# EAGLE design pci_stub (EAGLE 4.11)
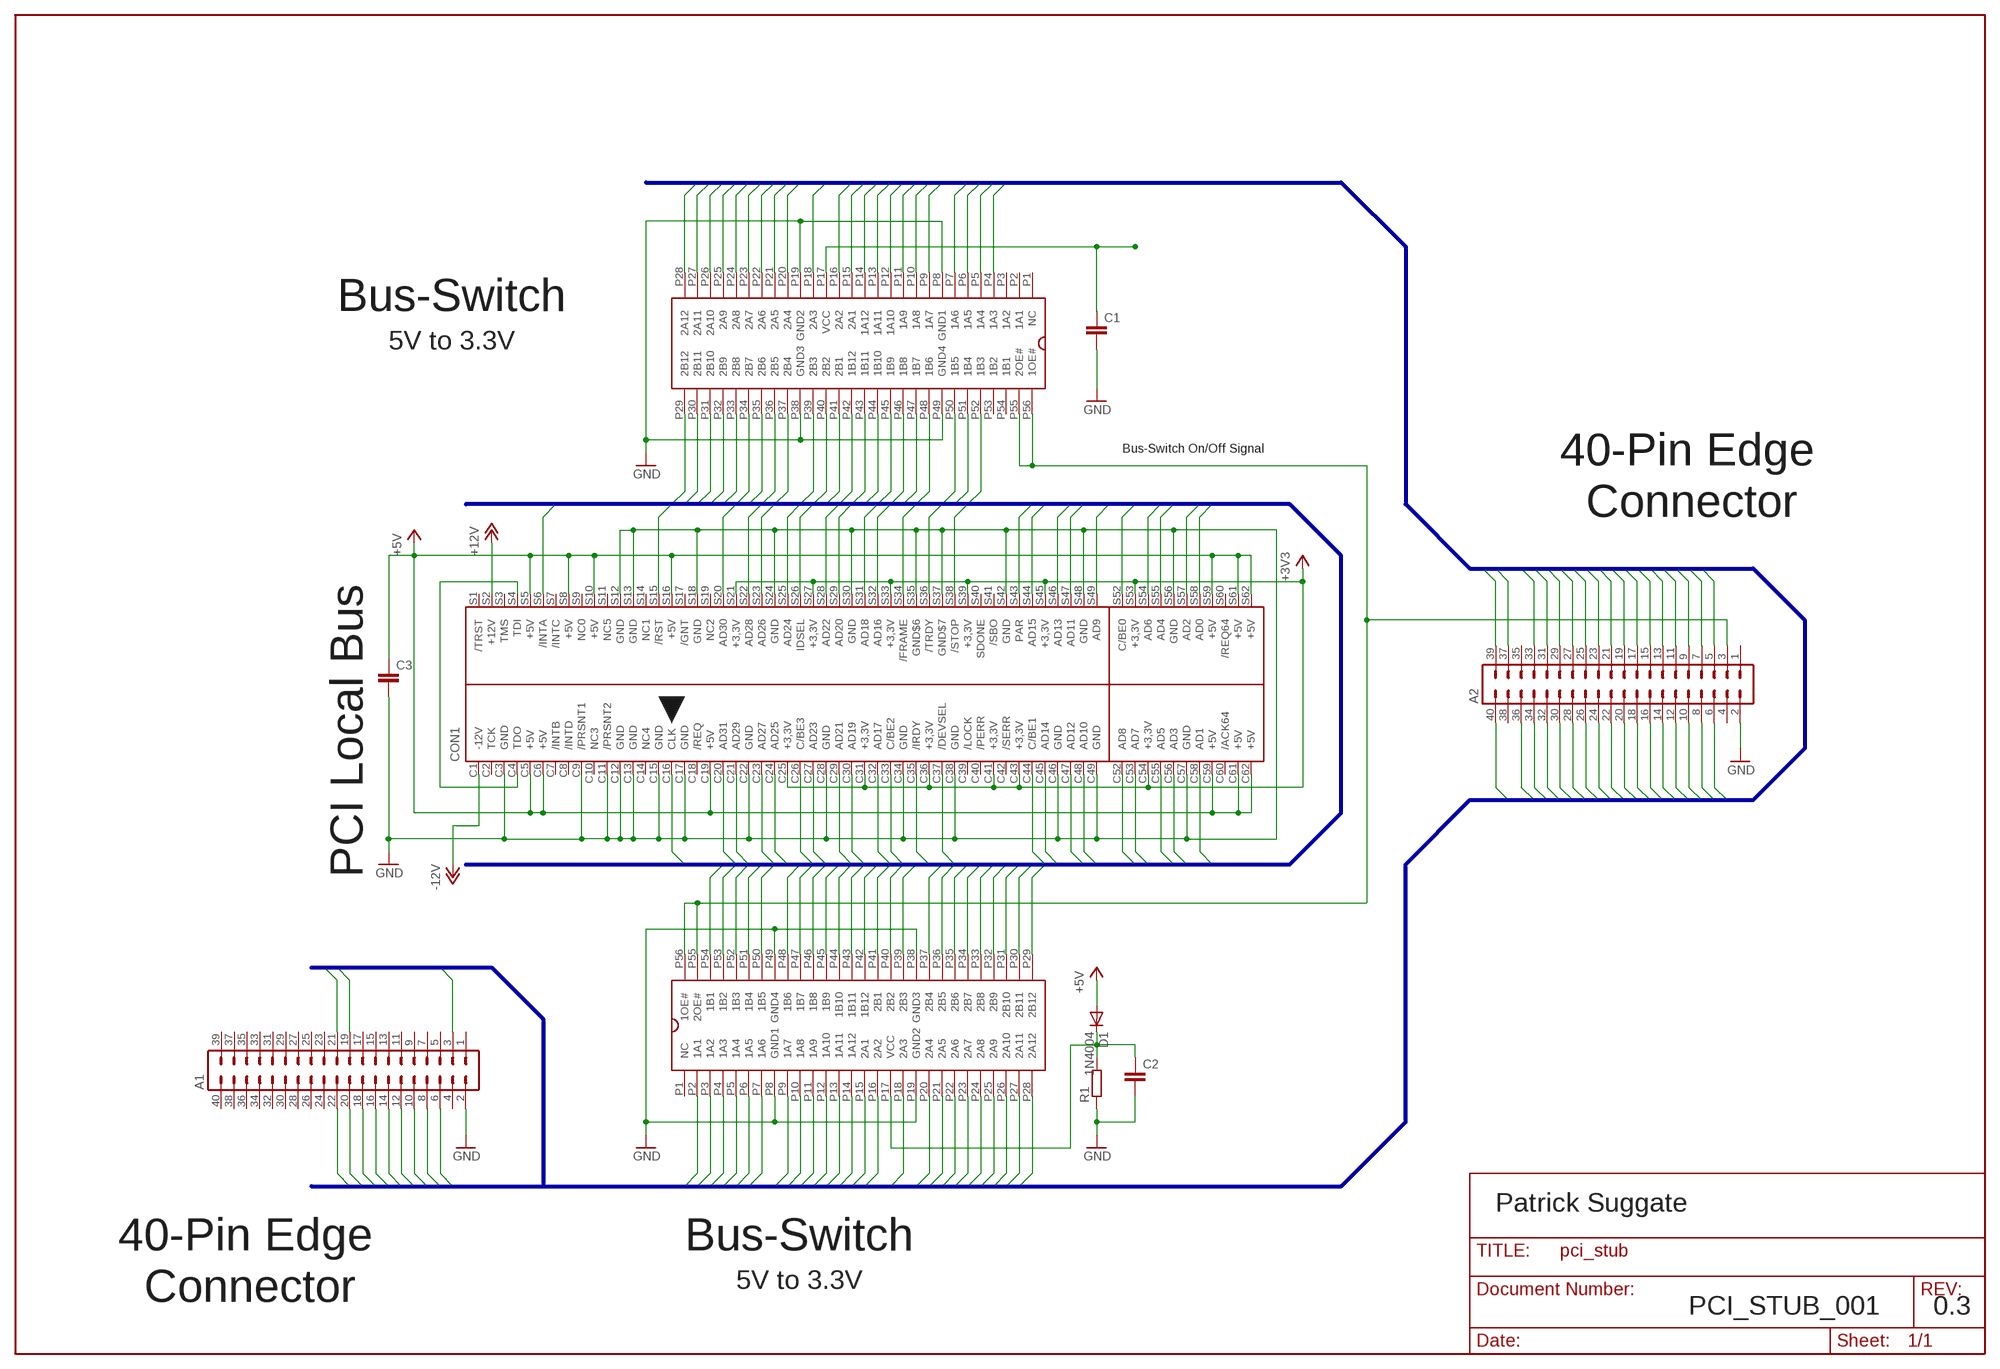
[diagram p0: schematic, sheet 1]

## Parts
A1  ML40L  [ML40L]
A2  ML40L  [ML40L]
C1  C-EU025-030X050  [C025-030X050]
C2  C-EU025-030X050  [C025-030X050]
C3  C-EU025-025X050  [C025-025X050]
CON1  PCI_CON  [PCI_BRDL]
D1  1N4004  [DO41-10]
R1  R-EU_0207/10  [0207/10]
U$1  CBT16211DDG  [TSSOP56]
U$2  CBT16211DDG  [TSSOP56]

## Nets
4.3V: C1.1 C2.1 D1.C R1.2 U$1.P17(VCC) U$2.P17(VCC)
+3V3: CON1.C25(+3,3V) CON1.C31(+3,3V) CON1.C36(+3,3V) CON1.C41(+3,3V) CON1.C43(+3,3V) CON1.C54(+3,3V) CON1.S21(+3,3V) CON1.S27(+3,3V) CON1.S33(+3,3V) CON1.S39(+3,3V) CON1.S45(+3,3V) CON1.S53(+3,3V)
+5V: C3.1 CON1.C5(+5V) CON1.C6(+5V) CON1.C19(+5V) CON1.C59(+5V) CON1.C61(+5V) CON1.C62(+5V) CON1.S5(+5V) CON1.S8(+5V) CON1.S10(+5V) CON1.S16(+5V) CON1.S59(+5V) CON1.S61(+5V) CON1.S62(+5V) D1.A
+12V: CON1.S2(+12V)
-12V: CON1.C1(-12V)
AD0: A2.39 U$1.P52(1B3)
AD1: A2.37 U$1.P51(1B4)
AD2: A2.33 U$1.P50(1B5)
AD3: A2.34 U$1.P48(1B6)
AD4: A2.31 U$1.P47(1B7)
AD5: A2.32 U$1.P46(1B8)
AD6: A2.29 U$1.P45(1B9)
AD7: A2.30 U$1.P44(1B10)
AD8: A2.28 U$1.P42(1B12)
AD9: A2.25 U$1.P41(2B1)
AD10: A2.26 U$1.P40(2B2)
AD11: A2.23 U$1.P39(2B3)
AD12: A2.24 U$1.P37(2B4)
AD13: A2.21 U$1.P36(2B5)
AD14: A2.22 U$1.P35(2B6)
AD15: A2.19 U$1.P34(2B7)
AD16: A2.11 U$2.P51(1B4)
AD17: A2.12 U$2.P50(1B5)
AD18: A2.9 U$2.P48(1B6)
AD19: A2.10 U$2.P47(1B7)
AD20: A2.7 U$2.P46(1B8)
AD21: A2.8 U$2.P45(1B9)
AD22: A2.5 U$2.P44(1B10)
AD23: A2.6 U$2.P43(1B11)
AD24: A1.19 U$2.P40(2B2)
AD25: A1.20 U$2.P39(2B3)
AD26: A1.18 U$2.P37(2B4)
AD27: A1.16 U$2.P36(2B5)
AD28: A1.14 U$2.P35(2B6)
AD29: A1.12 U$2.P34(2B7)
AD30: A1.10 U$2.P33(2B8)
AD31: A1.8 U$2.P32(2B9)
CBE0: A2.27 U$1.P43(1B11)
CBE1: A2.20 U$1.P33(2B8)
CBE2: A2.14 U$2.P52(1B3)
CBE3: A1.22 U$2.P41(2B1)
DEVSEL: A2.18 U$1.P30(2B11)
FRAME: A2.13 U$2.P53(1B2)
GND: A1.2 A2.2 C1.2 C2.2 C3.2 CON1.C3(GND) CON1.C9(/PRSNT1) CON1.C11(/PRSNT2) CON1.C12(GND) CON1.C13(GND) CON1.C15(GND) CON1.C17(GND) CON1.C22(GND) CON1.C28(GND) CON1.C34(GND) CON1.C38(GND) CON1.C46(GND) CON1.C49(GND) CON1.C57(GND) CON1.S12(GND) CON1.S13(GND) CON1.S18(GND) CON1.S24(GND) CON1.S30(GND) CON1.S35(GND$6) CON1.S37(GND$7) CON1.S42(GND) CON1.S48(GND) CON1.S56(GND) R1.1 U$1.P8(GND1) U$1.P19(GND2) U$1.P38(GND3) U$1.P49(GND4) U$2.P8(GND1) U$2.P19(GND2) U$2.P38(GND3) U$2.P49(GND4)
IDSEL: A1.21 U$2.P42(1B12)
INTA: A1.3 U$2.P29(2B12)
IRDY: A2.16 U$2.P54(1B1)
JTAG: CON1.C4(TDO) CON1.S4(TDI)
OE#: A2.3 U$1.P55(2OE#) U$1.P56(1OE#) U$2.P55(2OE#) U$2.P56(1OE#)
PAR: A2.17 U$1.P32(2B9)
PCI_AD0: CON1.S58(AD0) U$1.P4(1A3)
PCI_AD1: CON1.C58(AD1) U$1.P5(1A4)
PCI_AD2: CON1.S57(AD2) U$1.P6(1A5)
PCI_AD3: CON1.C56(AD3) U$1.P7(1A6)
PCI_AD4: CON1.S55(AD4) U$1.P9(1A7)
PCI_AD5: CON1.C55(AD5) U$1.P10(1A8)
PCI_AD6: CON1.S54(AD6) U$1.P11(1A9)
PCI_AD7: CON1.C53(AD7) U$1.P12(1A10)
PCI_AD8: CON1.C52(AD8) U$1.P14(1A12)
PCI_AD9: CON1.S49(AD9) U$1.P15(2A1)
PCI_AD10: CON1.C48(AD10) U$1.P16(2A2)
PCI_AD11: CON1.S47(AD11) U$1.P18(2A3)
PCI_AD12: CON1.C47(AD12) U$1.P20(2A4)
PCI_AD13: CON1.S46(AD13) U$1.P21(2A5)
PCI_AD14: CON1.C45(AD14) U$1.P22(2A6)
PCI_AD15: CON1.S44(AD15) U$1.P23(2A7)
PCI_AD16: CON1.S32(AD16) U$2.P5(1A4)
PCI_AD17: CON1.C32(AD17) U$2.P6(1A5)
PCI_AD18: CON1.S31(AD18) U$2.P7(1A6)
PCI_AD19: CON1.C30(AD19) U$2.P9(1A7)
PCI_AD20: CON1.S29(AD20) U$2.P10(1A8)
PCI_AD21: CON1.C29(AD21) U$2.P11(1A9)
PCI_AD22: CON1.S28(AD22) U$2.P12(1A10)
PCI_AD23: CON1.C27(AD23) U$2.P13(1A11)
PCI_AD24: CON1.S25(AD24) U$2.P16(2A2)
PCI_AD25: CON1.C24(AD25) U$2.P18(2A3)
PCI_AD26: CON1.S23(AD26) U$2.P20(2A4)
PCI_AD27: CON1.C23(AD27) U$2.P21(2A5)
PCI_AD28: CON1.S22(AD28) U$2.P22(2A6)
PCI_AD29: CON1.C21(AD29) U$2.P23(2A7)
PCI_AD30: CON1.S20(AD30) U$2.P24(2A8)
PCI_AD31: CON1.C20(AD31) U$2.P25(2A9)
PCI_CBE0: CON1.S52(C/BE0) U$1.P13(1A11)
PCI_CBE1: CON1.C44(C/BE1) U$1.P24(2A8)
PCI_CBE2: CON1.C33(C/BE2) U$2.P4(1A3)
PCI_CBE3: CON1.C26(C/BE3) U$2.P15(2A1)
PCI_CLK: CON1.C16(CLK) U$2.P26(2A10)
PCI_CLOCK: A2.36 U$2.P31(2B10)
PCI_DEVSEL: CON1.C37(/DEVSEL) U$1.P27(2A11)
PCI_FRAME: CON1.S34(/FRAME) U$2.P3(1A2)
PCI_IDSEL: CON1.S26(IDSEL) U$2.P14(1A12)
PCI_INTA: CON1.S6(/INTA) U$2.P28(2A12)
PCI_IRDY: CON1.C35(/IRDY) U$2.P2(1A1)
PCI_PAR: CON1.S43(PAR) U$1.P25(2A9)
PCI_RST: CON1.S15(/RST) U$2.P27(2A11)
PCI_STOP: CON1.S38(/STOP) U$1.P26(2A10)
PCI_TRDY: CON1.S36(/TRDY) U$1.P28(2A12)
RST: A1.6 U$2.P30(2B11)
STOP: A2.40 U$1.P31(2B10)
TRDY: A2.15 U$1.P29(2B12)
Unconnected: A1.1 A1.4 A1.5 A1.7 A1.9 A1.11 A1.13 A1.15 A1.17 A1.23 A1.24 A1.25 A1.26 A1.27 A1.28 A1.29 A1.30 A1.31 A1.32 A1.33 A1.34 A1.35 A1.36 A1.37 A1.38 A1.39 A1.40 A2.1 A2.4 A2.35 A2.38 CON1.C2(TCK) CON1.C7(/INTB) CON1.C8(/INTD) CON1.C10(NC3) CON1.C14(NC4) CON1.C18(/REQ) CON1.C39(/LOCK) CON1.C40(/PERR) CON1.C42(/SERR) CON1.C60(/ACK64) CON1.S1(/TRST) CON1.S3(TMS) CON1.S7(/INTC) CON1.S9(NC0) CON1.S11(NC5) CON1.S14(NC1) CON1.S17(/GNT) CON1.S19(NC2) CON1.S40(SDONE) CON1.S41(/SBO) CON1.S60(/REQ64) U$1.P1(NC) U$1.P2(1A1) U$1.P3(1A2) U$1.P53(1B2) U$1.P54(1B1) U$2.P1(NC)

## Buses
B$2

## Notes on the sheet
- Bus-Switch
- 5V to 3.3V
- Bus-Switch On/Off Signal
- 40-Pin Edge
- Connector
- PCI Local Bus
- Patrick Suggate
- 40-Pin Edge | Bus-Switch
- 5V to 3.3V
- Connector
- PCI_STUB_001 | 0.3

## Library data of the parts
A1 A2 = con-ml:ML40L: HARTING
C1-C3 = rcl:C-EU: CAPACITOR, European symbol
CON1 = pci-brd:PCI_CON: PCI BOARD LONG
D1 = diode:1N4004: DIODE general purpose rectifier, 1 A
R1 = rcl:R-EU_: RESISTOR, European symbol
U$1 U$2 = busswitch:CBT16211DDG

## Board
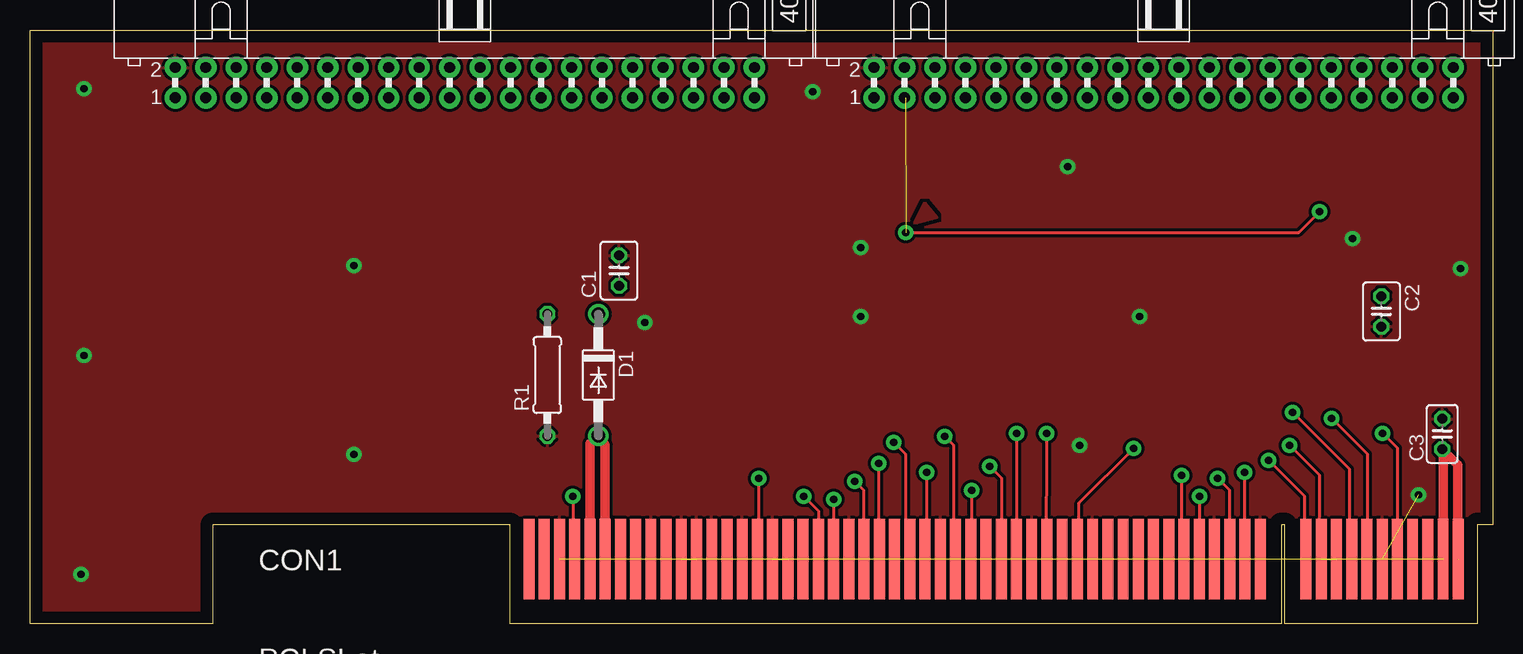
[diagram p1: board, top side]
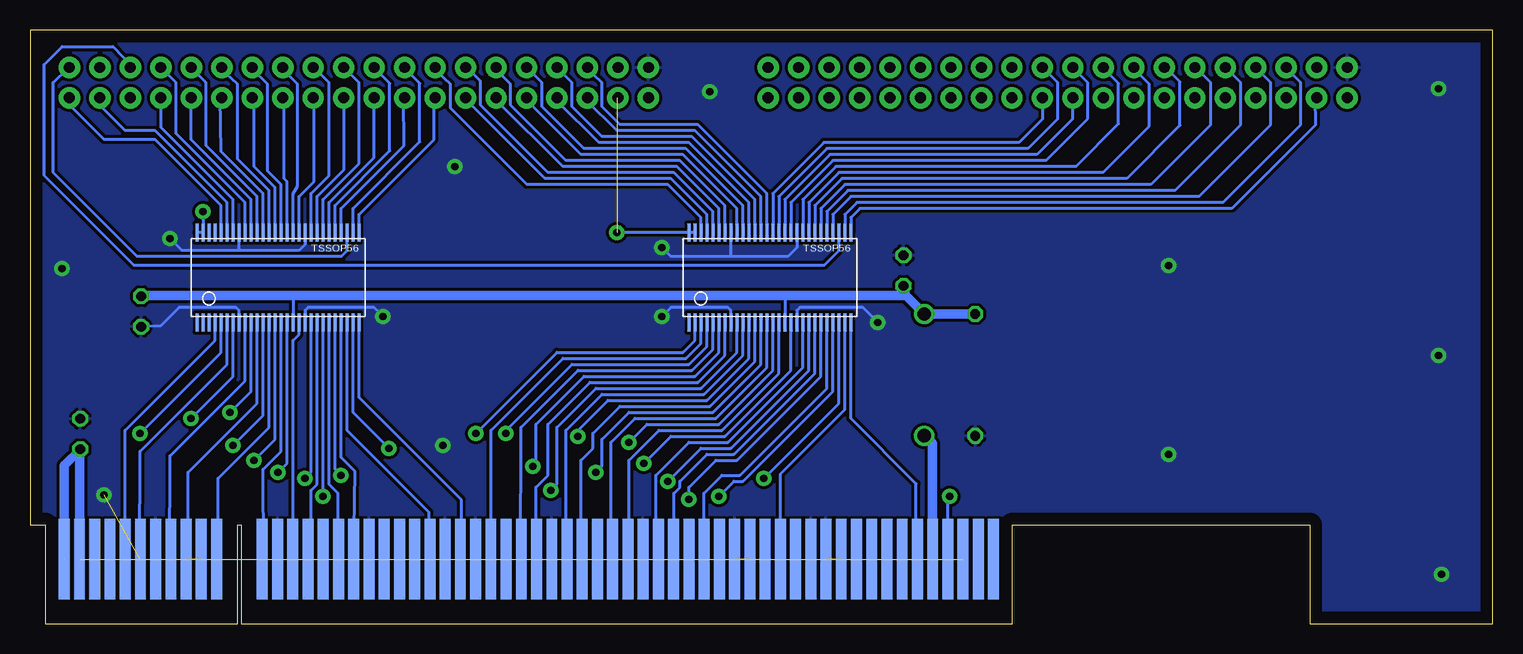
[diagram p2: board, bottom side, seen from below]

Size 121.92 x 49.53 mm. Coordinates in mm from the lower left corner, seen from the top.
Copper layers (1*16): Top 0.035mm / dielectric 1.5mm / Bottom 0.035mm
Design rules "default": minimum track width 8mil, minimum drill 24mil, track to track 8mil, track to pad 8mil, pad to pad 8mil, via to via 8mil, smd to smd 8mil, copper to edge 40mil, drill to drill 8mil, minimum pad ring 10mil, minimum via ring 8mil, stop-mask expansion 4mil, vias tented up to drill 0mil, thermal gap 10mil

### Footprints (pad centres in the part's own frame; a part is rotated, then mirrored left to right if it is on the bottom)
ML40L = drill 0.914 pad 1.778 round: 1 -24.13,-1.27; 2 -24.13,1.27; 3 -21.59,-1.27; 4 -21.59,1.27; 5 -19.05,-1.27; 6 -19.05,1.27; 7 -16.51,-1.27; 8 -16.51,1.27; 9 -13.97,-1.27; 10 -13.97,1.27; 11 -11.43,-1.27; 12 -11.43,1.27; 13 -8.89,-1.27; 14 -8.89,1.27; 15 -6.35,-1.27; 16 -6.35,1.27; 17 -3.81,-1.27; 18 -3.81,1.27; 19 -1.27,-1.27; 20 -1.27,1.27; 21 1.27,-1.27; 22 1.27,1.27; 23 3.81,-1.27; 24 3.81,1.27; 25 6.35,-1.27; 26 6.35,1.27; 27 8.89,-1.27; 28 8.89,1.27; 29 11.43,-1.27; 30 11.43,1.27; 31 13.97,-1.27; 32 13.97,1.27; 33 16.51,-1.27; 34 16.51,1.27; 35 19.05,-1.27; 36 19.05,1.27; 37 21.59,-1.27; 38 21.59,1.27; 39 24.13,-1.27; 40 24.13,1.27
C025-030X050 = drill 0.813 octagon: 1 -1.27,0; 2 1.27,0
C025-025X050 = drill 0.813 octagon: 1 -1.27,0; 2 1.27,0
PCI_BRDL = smd 0.91 x 6.7: C1 41.593,4.763; C2 42.862,4.763; C3 44.133,4.763; C4 45.403,4.763; C5 46.672,4.763; C6 47.943,4.763; C7 49.212,4.763; C8 50.483,4.763; C9 51.752,4.763; C10 53.023,4.763; C11 54.292,4.763; C12 55.562,4.763; C13 56.833,4.763; C14 58.102,4.763; C15 59.373,4.763; C16 60.642,4.763; C17 61.913,4.763; C18 63.182,4.763; C19 64.453,4.763; C20 65.722,4.763; C21 66.993,4.763; C22 68.263,4.763; C23 69.532,4.763; C24 70.802,4.763; C25 72.073,4.763; C26 73.343,4.763; C27 74.612,4.763; C28 75.882,4.763; C29 77.153,4.763; C30 78.422,4.763; C31 79.692,4.763; C32 80.963,4.763; C33 82.233,4.763; C34 83.502,4.763; C35 84.772,4.763; C36 86.043,4.763; C37 87.312,4.763; C38 88.582,4.763; C39 89.853,4.763; C40 91.123,4.763; C41 92.392,4.763; C42 93.662,4.763; C43 94.933,4.763; C44 96.203,4.763; C45 97.472,4.763; C46 98.743,4.763; C47 100.013,4.763; C48 101.282,4.763; C49 102.552,4.763; C52 106.362,4.763; C53 107.632,4.763; C54 108.903,4.763; C55 110.172,4.763; C56 111.442,4.763; C57 112.713,4.763; C58 113.983,4.763; C59 115.252,4.763; C60 116.522,4.763; C61 117.793,4.763; C62 119.062,4.763 | smd 0.91 x 6.7 bottom: S1 41.593,4.763; S2 42.862,4.763; S3 44.133,4.763; S4 45.403,4.763; S5 46.672,4.763; S6 47.943,4.763; S7 49.212,4.763; S8 50.483,4.763; S9 51.752,4.763; S10 53.023,4.763; S11 54.292,4.763; S12 55.562,4.763; S13 56.833,4.763; S14 58.102,4.763; S15 59.373,4.763; S16 60.642,4.763; S17 61.913,4.763; S18 63.182,4.763; S19 64.453,4.763; S20 65.722,4.763; S21 66.993,4.763; S22 68.263,4.763; S23 69.532,4.763; S24 70.802,4.763; S25 72.073,4.763; S26 73.343,4.763; S27 74.612,4.763; S28 75.882,4.763; S29 77.153,4.763; S30 78.422,4.763; S31 79.692,4.763; S32 80.963,4.763; S33 82.233,4.763; S34 83.502,4.763; S35 84.772,4.763; S36 86.043,4.763; S37 87.312,4.763; S38 88.582,4.763; S39 89.853,4.763; S40 91.123,4.763; S41 92.392,4.763; S42 93.662,4.763; S43 94.933,4.763; S44 96.203,4.763; S45 97.472,4.763; S46 98.743,4.763; S47 100.013,4.763; S48 101.282,4.763; S49 102.552,4.763; S52 106.362,4.763; S53 107.632,4.763; S54 108.903,4.763; S55 110.172,4.763; S56 111.442,4.763; S57 112.713,4.763; S58 113.983,4.763; S59 115.252,4.763; S60 116.522,4.763; S61 117.793,4.763; S62 119.062,4.763
DO41-10 = drill 1.118 round: A 5.08,0; C -5.08,0
0207/10 = drill 0.813 octagon: 1 -5.08,0; 2 5.08,0
TSSOP56 = smd 1.524 x 0.254: P1 -5.5,7.5; P2 -5.5,7; P3 -5.5,6.5; P4 -5.5,6; P5 -5.5,5.5; P6 -5.5,5; P7 -5.5,4.5; P8 -5.5,4; P9 -5.5,3.5; P10 -5.5,3; P11 -5.5,2.5; P12 -5.5,2; P13 -5.5,1.5; P14 -5.5,1; P15 -5.5,0.5; P16 -5.5,0; P17 -5.5,-0.5; P18 -5.5,-1; P19 -5.5,-1.5; P20 -5.5,-2; P21 -5.5,-2.5; P22 -5.5,-3; P23 -5.5,-3.5; P24 -5.5,-4; P25 -5.5,-4.5; P26 -5.5,-5; P27 -5.5,-5.5; P28 -5.5,-6; P29 2,-6; P30 2,-5.5; P31 2,-5; P32 2,-4.5; P33 2,-4; P34 2,-3.5; P35 2,-3; P36 2,-2.5; P37 2,-2; P38 2,-1.5; P39 2,-1; P40 2,-0.5; P41 2,0; P42 2,0.5; P43 2,1; P44 2,1.5; P45 2,2; P46 2,2.5; P47 2,3; P48 2,3.5; P49 2,4; P50 2,4.5; P51 2,5; P52 2,5.5; P53 2,6; P54 2,6.5; P55 2,7; P56 2,7.5

### Placement (x,y rotation side)
A1  36.25,45.13 0 top
A2  94.5,45.13 0 top
C1  49.1,29.46 90 top
C2  112.66,26.06 270 top
C3  117.72,15.84 90 top
CON1  0,0.64 0 top
D1  47.38,20.76 270 top
R1  43.12,20.76 90 top
U$1  100.5,30.64 90 bottom
U$2  59.5,30.64 90 bottom

### Tracks (layer width: path | path; a pad name or v marks a point on that pad's centre or on a via)
4.3V
  Bottom 0.254: D1.C 47.25,25.84 47.25,25.64 | 48.92,27.39 49,27.39 | C2.1 112.62,27.36 112.62,27.39 | 100,27.39 U$1.P17 | 59,27.39 U$2.P17
  Bottom 0.8: R1.2 47.25,25.84 | D1.C 48.92,27.39 | 112.62,27.39 100,27.39 59,27.39 49,27.39 49,28.1 C1.1
+3V3  (11 unrouted)
+5V  (8 unrouted)
  Top 0.254: D1.A 47.3,15.68 47.25,15.63 46.69,15.07 46.67,15.06 | 117.79,14.47 117.75,14.51 | 119.11,5.4 119.12,5.38 | 119.11,5.4 CON1.S62 | 119,5.51 119.11,5.4
  Top 0.8: CON1.C6 47.94,14.94 47.25,15.63 | CON1.S61 117.79,14.47 119,13.26 119,5.51 | 46.67,15.06 CON1.S5
  Bottom 0.254: 46.62,5.38 46.64,5.4 CON1.S5 | 117.79,14.47 117.75,14.51 117.72,14.54 C3.1 | 47.31,15.7 47.33,15.68 D1.A
  Bottom 0.8: CON1.S61 117.79,14.47 | CON1.S62 119.06,13.2 117.75,14.51 | CON1.S5 46.67,15.06 47.31,15.7
AD0
  Bottom 0.254: U$1.P52 106,34.88 111.5,40.38 115.75,40.38 118.62,43.26 118.6,43.88 A2.39
AD1
  Bottom 0.254: U$1.P51 105.5,35.13 111.5,41.13 114,41.13 116.12,43.26 116.12,43.92 A2.37
AD2
  Bottom 0.254: U$1.P50 105,35.38 111,41.38 111,43.88 A2.33
AD3
  Bottom 0.254: U$1.P48 104,35.13 109.75,40.88 109.75,45.13 111,46.38 A2.34
AD4
  Bottom 0.254: U$1.P47 103.5,35.38 108.5,40.38 108.48,43.91 A2.31
AD5
  Bottom 0.254: U$1.P46 103,35.63 107.25,39.88 107.25,45.13 108.48,46.35 A2.32
AD6
  Bottom 0.254: U$1.P45 102.5,35.88 106,39.38 106.05,43.92 A2.29
AD7
  Bottom 0.254: U$1.P44 102,36.13 104.62,38.76 104.62,45.01 106.05,46.34 A2.30
AD8
  Bottom 0.254: U$1.P42 101,36.63 102.12,37.76 102.12,45.01 103.47,46.34 A2.28
AD9
  Bottom 0.254: U$1.P41 100.5,36.88 100.75,37.13 100.73,43.91 A2.25
AD10
  Bottom 0.254: U$1.P40 100,35.88 99.62,36.51 99.62,45.01 101.02,46.36 A2.26
AD11
  Bottom 0.254: U$1.P39 99.5,35.63 98.25,36.88 98.23,43.91 A2.23
AD12
  Bottom 0.254: U$1.P37 98.5,35.88 97,37.38 97,45.13 98.23,46.36 A2.24
AD13
  Bottom 0.254: U$1.P36 98,35.63 95.75,37.88 95.75,43.88 A2.21
AD14
  Bottom 0.254: U$1.P35 97.5,35.38 94.5,38.38 94.5,45.13 A2.22
AD15
  Bottom 0.254: U$1.P34 97,35.13 93.25,38.88 93.23,43.91 A2.19
AD16
  Bottom 0.254: U$2.P51 64.5,34.63 68,38.13 77.5,38.13 83.14,43.77 A2.11
AD17
  Bottom 0.254: U$2.P50 64,34.88 67.75,38.63 77.25,38.63 81.88,43.26 81.88,45.01 83.27,46.36 A2.12
AD18
  Bottom 0.254: U$2.P48 63,34.63 67.5,39.13 76,39.13 80.5,43.63 80.5,43.88 A2.9
AD19
  Bottom 0.254: U$2.P47 62.5,34.88 67.25,39.63 75.75,39.63 79.25,43.13 79.25,45.13 80.5,46.38 A2.10
AD20
  Bottom 0.254: U$2.P46 62,35.13 67,40.13 74.5,40.13 77.97,43.6 A2.7
AD21
  Bottom 0.254: U$2.P45 61.5,35.38 66.75,40.63 74.25,40.63 76.75,43.13 76.75,45.13 77.98,46.36 A2.8
AD22
  Bottom 0.254: U$2.P44 61,35.63 66.5,41.13 73,41.13 75.51,43.62 A2.5
AD23
  Bottom 0.254: U$2.P43 60.5,35.88 66.25,41.63 72.75,41.63 74.25,43.13 74.25,45.13 75.52,46.35 A2.6
AD24
  Bottom 0.254: U$2.P40 59,35.38 55.25,39.13 38,39.13 35,42.13 35,43.88 A1.19
AD25
  Bottom 0.254: U$2.P39 58.5,35.13 55,38.63 37.25,38.63 33.75,42.13 33.75,45.13 35,46.38 A1.20
AD26
  Bottom 0.254: U$2.P37 57.5,35.38 54.75,38.13 34.75,38.13 31.19,41.7 31.19,45.07 32.52,46.36 A1.18
AD27
  Bottom 0.254: U$2.P36 57,35.13 54.5,37.63 32.5,37.63 28.62,41.51 28.62,45.01 30.02,46.36 A1.16
AD28
  Bottom 0.254: U$2.P35 56.5,34.88 54.25,37.13 30.5,37.13 26.06,41.57 26.06,45.2 27.23,46.36 A1.14
AD29
  Bottom 0.254: U$2.P34 56,34.63 54,36.63 28.5,36.63 23.5,41.63 23.5,45.13 24.73,46.36 A1.12
AD30
  Bottom 0.254: U$2.P33 55.5,34.38 53.75,36.13 26.5,36.13 21,41.63 21,45.13 22.25,46.38 A1.10
AD31
  Bottom 0.254: U$2.P32 55,34.13 53.5,35.63 24.5,35.63 18.5,41.63 18.5,45.13 19.76,46.38 A1.8
CBE0
  Bottom 0.254: U$1.P43 101.5,36.38 103.25,38.13 103.25,43.63 103.47,43.92 A2.27
CBE1
  Bottom 0.254: U$1.P33 96.5,34.88 91.94,39.45 91.94,45.07 A2.20
CBE2
  Bottom 0.254: U$2.P52 65,34.38 68.25,37.63 78.75,37.63 84.38,43.26 84.38,45.26 85.48,46.36 A2.14
CBE3
  Bottom 0.254: U$2.P41 59.5,35.63 55.5,39.63 38.75,39.63 36.25,42.13 36.25,45.13 A1.22
DEVSEL
  Bottom 0.254: U$1.P30 95,34.63 89.44,40.2 89.44,45.07 90.77,46.36 A2.18
FRAME
  Bottom 0.254: U$2.P53 65.5,34.13 68.5,37.13 79,37.13 85.62,43.76 85.59,43.91 A2.13
GND  (via drill 0.61 pad 1.27)  (24 unrouted)
  Bottom 0.254: U$1.P8 104.5,26.14 104.75,26.39 109.5,26.39 111.03,24.86 C2.2 | U$1.P19 99,26.14 98.75,26.39 93.25,26.39 v92.5,25.64 | U$1.P38 99,31.64 99.5,31.14 104.5,31.14 | 104.5,31.14 109.25,31.14 v110.25,32.13 | 104.5,31.14 U$1.P49 | U$2.P38 58,31.39 58.75,30.64 63.5,30.64 | 63.5,30.64 68.5,30.64 v69.25,31.39 | 63.5,30.64 U$2.P49 | U$2.P19 58,26.14 57.75,26.39 52.5,26.39 v51.25,25.14 | U$2.P8 63.5,26.14 63.75,26.39 68.5,26.39 v69.25,25.64
  other vias: 86.5,38.13 119.25,29.64 115.75,10.76 27,14.13 27,29.89 4.5,44.63 4.5,22.39 4.25,4.13 65.25,44.38 87.5,14.88
  pour Top (isolate 0.254, rank 4): 0,48.88 0,0.64 15.25,0.64 15.25,8.38 40,8.38 40,5.63 121.5,5.63 121.5,48.88
  pour Bottom (isolate 0.254, rank 4): 0,48.88 0,0.64 15.25,0.64 15.25,8.38 40.25,8.38 40.25,5.88 121.25,5.88 121.25,48.88
IDSEL
  Bottom 0.254: U$2.P42 60,35.88 55.75,40.13 39.5,40.13 37.5,42.13 37.5,43.88 A1.21
INTA
  Bottom 0.254: U$2.P29 53.5,33.88 52.75,34.63 21.75,34.63 14.75,41.63 14.77,43.91 A1.3
IRDY
  Bottom 0.254: U$2.P54 66,33.88 68.75,36.63 80.5,36.63 86.88,43.01 86.88,45.01 88.33,46.34 A2.16
JTAG  (via drill 0.61 pad 1.27)
  Top 0.254: 45.49,5.4 45.5,5.38 | 45.49,5.4 CON1.S4 | v45.25,10.63 45.25,5.63 45.49,5.4
  Bottom 0.254: CON1.S4 45.4,10.48 v45.25,10.63
N$1
  pour Top (rank 2): 73.75,33.49 74.62,35.13 75.63,33.89 73.75,33.37
OE#  (via drill 0.61 pad 1.27)  (1 unrouted)
  Top 0.254: 73,43.88 72.98,43.86 A2.3 | v73,32.63 105.75,32.63 v107.5,34.38
  Bottom 0.254: U$2.P55 U$2.P56 v73,32.63 | U$1.P56 U$1.P55 v107.5,34.38
PAR
  Bottom 0.254: U$1.P32 96,34.63 90.75,39.88 90.77,43.91 A2.17
PCI_AD0
  Bottom 0.254: U$1.P4 106.5,23.64 114,16.14 114,5.38 CON1.S58
PCI_AD1  (via drill 0.61 pad 1.27)
  Top 0.254: v112.75,15.88 114,14.63 114,5.38 CON1.C58
  Bottom 0.254: U$1.P5 106,22.64 v112.75,15.88
PCI_AD2
  Bottom 0.254: U$1.P6 105.5,21.64 112.75,14.38 112.79,5.67 CON1.S57
PCI_AD3  (via drill 0.61 pad 1.27)
  Top 0.254: v108.5,17.14 111.5,14.13 111.5,5.38 111.49,5.4 CON1.C56 111.51,5.37
  Bottom 0.254: U$1.P7 105,20.64 v108.5,17.14
PCI_AD4
  Bottom 0.254: U$1.P9 104,20.26 110.25,14.01 110.26,5.37 CON1.S55
PCI_AD5  (via drill 0.61 pad 1.27)
  Top 0.254: v105.25,17.64 110,12.88 110,5.63 110.26,5.37 CON1.C55
  Bottom 0.254: U$1.P10 103.5,19.39 v105.25,17.64
PCI_AD6
  Bottom 0.254: U$1.P11 103,18.39 108.75,12.63 108.75,5.63 109.01,5.37 CON1.S54
PCI_AD7  (via drill 0.61 pad 1.27)
  Top 0.254: v105,14.88 107.5,12.38 107.49,5.37 CON1.C53
  Bottom 0.254: U$1.P12 102.5,17.39 v105,14.88
PCI_AD8  (via drill 0.61 pad 1.27)
  Top 0.254: v103.25,13.63 106.25,10.63 106.24,5.37 CON1.C52
  Bottom 0.254: U$1.P14 101.5,15.38 v103.25,13.63
PCI_AD9
  Bottom 0.254: U$1.P15 101,14.38 102.5,12.88 102.45,5.69 CON1.S49
PCI_AD10  (via drill 0.61 pad 1.27)
  Top 0.254: 101.24,5.37 CON1.C48 101.26,5.4 101.25,5.38 v101.25,12.63
  Bottom 0.254: U$1.P16 100.5,13.38 v101.25,12.63
PCI_AD11
  Bottom 0.254: U$1.P18 99.5,24.14 100,23.64 CON1.S47
PCI_AD12  (via drill 0.61 pad 1.27)
  Top 0.254: v99,12.13 100,11.13 CON1.C47
  Bottom 0.254: U$1.P20 98.5,12.63 v99,12.13
PCI_AD13
  Bottom 0.254: U$1.P21 98,11.63 98.5,11.13 98.5,5.63 98.76,5.38 CON1.S46
PCI_AD14  (via drill 0.61 pad 1.27)
  Top 0.254: CON1.C45 97.51,5.37 v97.5,10.63
  Bottom 0.254: v97.5,10.63 U$1.P22
PCI_AD15
  Bottom 0.254: U$1.P23 97,11.63 96.25,10.88 96.26,5.37 CON1.S44
PCI_AD16
  Bottom 0.254: U$2.P5 65,22.89 66.75,21.14 76.25,21.14 81,16.39 81.01,5.37 CON1.S32
PCI_AD17  (via drill 0.61 pad 1.27)
  Top 0.254: v80,13.13 81,12.13 81.01,5.37 CON1.C32
  Bottom 0.254: U$2.P6 64.5,22.64 66.5,20.64 75.75,20.64 79.75,16.64 79.75,13.38 v80,13.13
PCI_AD18
  Bottom 0.254: U$2.P7 64,22.39 66.25,20.14 75.25,20.14 78.75,16.64 78.75,12.38 79.75,11.38 79.76,5.37 CON1.S31
PCI_AD19  (via drill 0.61 pad 1.27)
  Top 0.254: CON1.C30 78.51,5.37 v78.5,11.13
  Bottom 0.254: U$2.P9 63,22.64 66,19.64 74.75,19.64 78,16.39 78,11.63 v78.5,11.13
PCI_AD20
  Bottom 0.254: U$2.P10 62.5,22.39 65.75,19.14 74.25,19.14 77.25,16.14 77.25,5.38 77.24,5.4 CON1.S29
PCI_AD21  (via drill 0.61 pad 1.27)
  Top 0.254: v76.25,15.63 77,14.88 77,5.38 77.01,5.4 CON1.C29
  Bottom 0.254: U$2.P11 62,22.14 65.5,18.64 73.75,18.64 76.25,16.14 v76.25,15.63
PCI_AD22
  Bottom 0.254: U$2.P12 61.5,21.89 65.25,18.14 72.75,18.14 75,15.88 75,14.63 76,13.63 75.99,5.37 CON1.S28
PCI_AD23  (via drill 0.61 pad 1.27)
  Top 0.254: CON1.C27 74.49,5.37 74.75,5.63 v74.75,12.63
  Bottom 0.254: U$2.P13 61,21.64 65,17.64 72,17.64 74.25,15.38 74.25,13.13 v74.75,12.63
PCI_AD24
  Bottom 0.254: U$2.P16 59.5,20.89 64.25,16.14 69.5,16.14 72,13.63 72,5.38 CON1.S25
PCI_AD25  (via drill 0.61 pad 1.27)
  Top 0.254: 70.71,5.38 CON1.C24 70.76,5.4 70.75,5.38 v70.75,13.38
  Bottom 0.254: U$2.P18 58.5,21.14 64,15.63 68.5,15.63 v70.75,13.38
PCI_AD26
  Bottom 0.254: U$2.P20 57.5,21.39 63.75,15.13 67,15.13 69.75,12.38 69.75,5.65 CON1.S23
PCI_AD27  (via drill 0.61 pad 1.27)
  Top 0.254: CON1.C23 69.48,5.38 69.5,11.13 v68.75,11.88
  Bottom 0.254: U$2.P21 57,21.14 63.5,14.63 66,14.63 v68.75,11.88
PCI_AD28
  Bottom 0.254: U$2.P22 56.5,20.89 63.25,14.13 65.5,14.13 67.75,11.88 67.75,11.38 68.25,10.88 CON1.S22
PCI_AD29  (via drill 0.61 pad 1.27)
  Top 0.254: CON1.C21 67.01,5.38 v67,10.38
  Bottom 0.254: U$2.P23 56,20.64 63,13.63 64.75,13.63 67,11.38 v67,10.38
PCI_AD30
  Bottom 0.254: U$2.P24 55.5,19.64 62.75,12.38 64.25,12.38 65.75,10.88 65.76,5.37 CON1.S20
PCI_AD31  (via drill 0.61 pad 1.27)
  Top 0.254: v64.5,10.63 65.75,9.38 65.76,5.37 CON1.C20
  Bottom 0.254: U$2.P25 55,19.39 62.5,11.88 63.25,11.88 v64.5,10.63
PCI_CBE0
  Bottom 0.254: U$1.P13 102,16.39 106.25,12.13 106.24,5.37 CON1.S52
PCI_CBE1  (via drill 0.61 pad 1.27)
  Top 0.254: CON1.C44 96.26,5.37 96,5.38 v96,12.38
  Bottom 0.254: U$1.P24 96.5,12.88 v96,12.38
PCI_CBE2  (via drill 0.61 pad 1.27)
  Top 0.254: CON1.C33 82.25,5.38 v82.25,15.88
  Bottom 0.254: U$2.P4 65.5,23.14 67,21.64 76.75,21.64 82.25,16.14 v82.25,15.88
PCI_CBE3  (via drill 0.61 pad 1.27)
  Top 0.254: v72,15.13 73,14.13 73,5.63 73.25,5.38 73.26,5.4 CON1.C26
  Bottom 0.254: U$2.P15 60,21.14 64.5,16.64 70.5,16.64 v72,15.13
PCI_CLK  (via drill 0.61 pad 1.27)
  Top 0.254: CON1.C16 60.76,5.37 v60.75,12.13
  Bottom 0.254: U$2.P26 54.5,18.39 v60.75,12.13
PCI_CLOCK
  Bottom 0.254: U$2.P31 54.5,31.14 55.75,29.89 113.25,29.89 120.75,37.38 120.75,46.63 119.25,48.13 115,48.13 113.53,46.6 113.69,46.45 A2.36
PCI_DEVSEL  (via drill 0.61 pad 1.27)
  Top 0.203: 87.26,5.4 87.25,5.38 | CON1.C37 87.26,5.4 | 87.44,5.57 87.26,5.4
  Top 0.254: v92,14.63 87.44,10.07 87.44,5.57
  Bottom 0.254: v92,14.63 95,17.64 U$1.P27
PCI_FRAME
  Bottom 0.254: U$2.P3 66,23.39 67.25,22.14 77.5,22.14 83.5,16.14 83.5,5.38 CON1.S34
PCI_IDSEL
  Bottom 0.254: U$2.P14 60.5,21.39 64.75,17.14 71.5,17.14 73.5,15.13 73.5,5.63 73.24,5.37 CON1.S26
PCI_INTA
  Bottom 0.254: U$2.P28 53.5,17.14 48.06,11.69 48.06,5.57 47.89,5.4 | 47.89,5.4 47.88,5.38 | CON1.S6 47.89,5.4
PCI_IRDY  (via drill 0.61 pad 1.27)
  Top 0.254: CON1.C35 84.74,5.38 v84.75,15.88
  Bottom 0.254: U$2.P2 66.5,23.64 67.5,22.64 78,22.64 v84.75,15.88
PCI_PAR
  Bottom 0.254: CON1.S43 94.82,12.7 96,13.88 U$1.P25
PCI_RST
  Bottom 0.254: CON1.S15 59.38,12.51 54,17.89 U$2.P27
PCI_STOP
  Bottom 0.254: U$1.P26 95.5,16.14 88.67,9.3 88.67,5.55 88.51,5.4 | 88.51,5.4 88.5,5.38 | CON1.S38 88.51,5.4
PCI_TRDY
  Bottom 0.254: U$1.P28 94.5,18.89 85.96,10.34 85.96,5.43 86,5.38 86.01,5.4 CON1.S36
RST
  Bottom 0.254: U$2.P30 54,34.13 53,35.13 22.5,35.13 16,41.63 16,45.13 17.27,46.36 A1.6
STOP
  Bottom 0.254: U$1.P31 95.5,31.14 96,30.64 113,30.64 120,37.63 120,45.13 118.72,46.34 A2.40
TRDY
  Bottom 0.254: U$1.P29 94.5,34.13 88.25,40.38 88.25,43.88 88.23,43.86 A2.15

### Text on the board
tTopText: A1 | A2 | Flying Lead | PCI Stub | Patrick Suggate (c) 2005
tBottomText: PCI Stub | Patrick Suggate (c) 2005